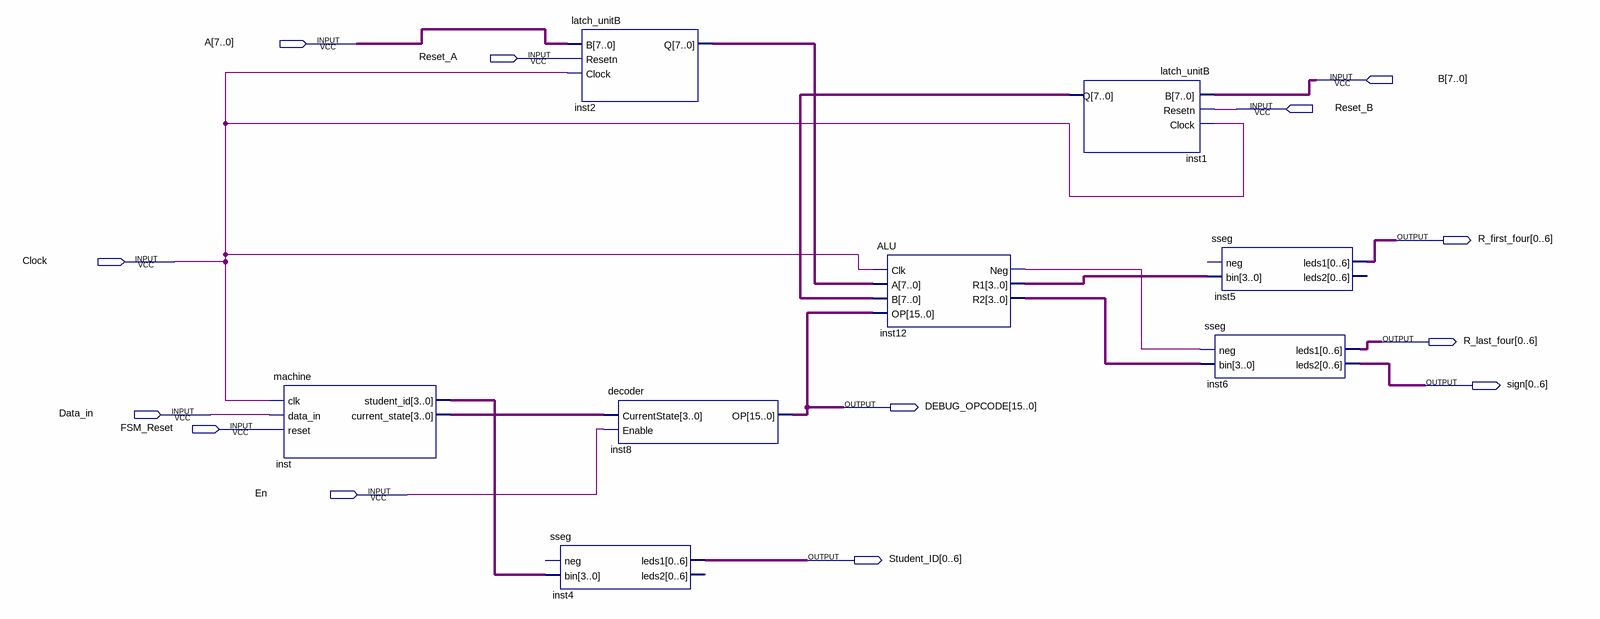
[diagram p0: schematic sheet]
// Quartus schematic moore_machine.bdf as structural Verilog: 8 symbols, 13 pins
module moore_machine (
  input  [7:0] A,
  input  Reset_A,
  input  [7:0] B,
  input  Reset_B,
  input  Clock,
  input  Data_in,
  input  FSM_Reset,
  input  En,
  output [0:6] R_first_four,
  output [0:6] R_last_four,
  output [0:6] sign,
  output [15:0] DEBUG_OPCODE,
  output [0:6] Student_ID
);

  wire inst12_neg;
  wire [3:0] inst12_r1, inst12_r2, inst_current_state, inst_student_id;
  wire [7:0] inst1_q, inst2_q;

  machine inst (
    .clk(Clock), .data_in(Data_in), .reset(FSM_Reset), .student_id(inst_student_id),
    .current_state(inst_current_state));
  sseg inst4 (.bin(inst_student_id), .leds1(Student_ID));  // open: neg, leds2
  latch_unitB inst2 (.B(A), .Resetn(Reset_A), .Clock(Clock), .Q(inst2_q));
  decoder inst8 (.CurrentState(inst_current_state), .Enable(En), .OP(DEBUG_OPCODE));
  ALU inst12 (
    .Clk(Clock), .A(inst2_q), .B(inst1_q), .OP(DEBUG_OPCODE), .Neg(inst12_neg), .R1(inst12_r1), .R2(inst12_r2));
  latch_unitB inst1 (.B(B), .Resetn(Reset_B), .Clock(Clock), .Q(inst1_q));
  sseg inst5 (.bin(inst12_r1), .leds1(R_first_four));  // open: neg, leds2
  sseg inst6 (.neg(inst12_neg), .bin(inst12_r2), .leds1(R_last_four), .leds2(sign));
endmodule
